# EAGLE design old_line_kick (EAGLE 7.7.0)
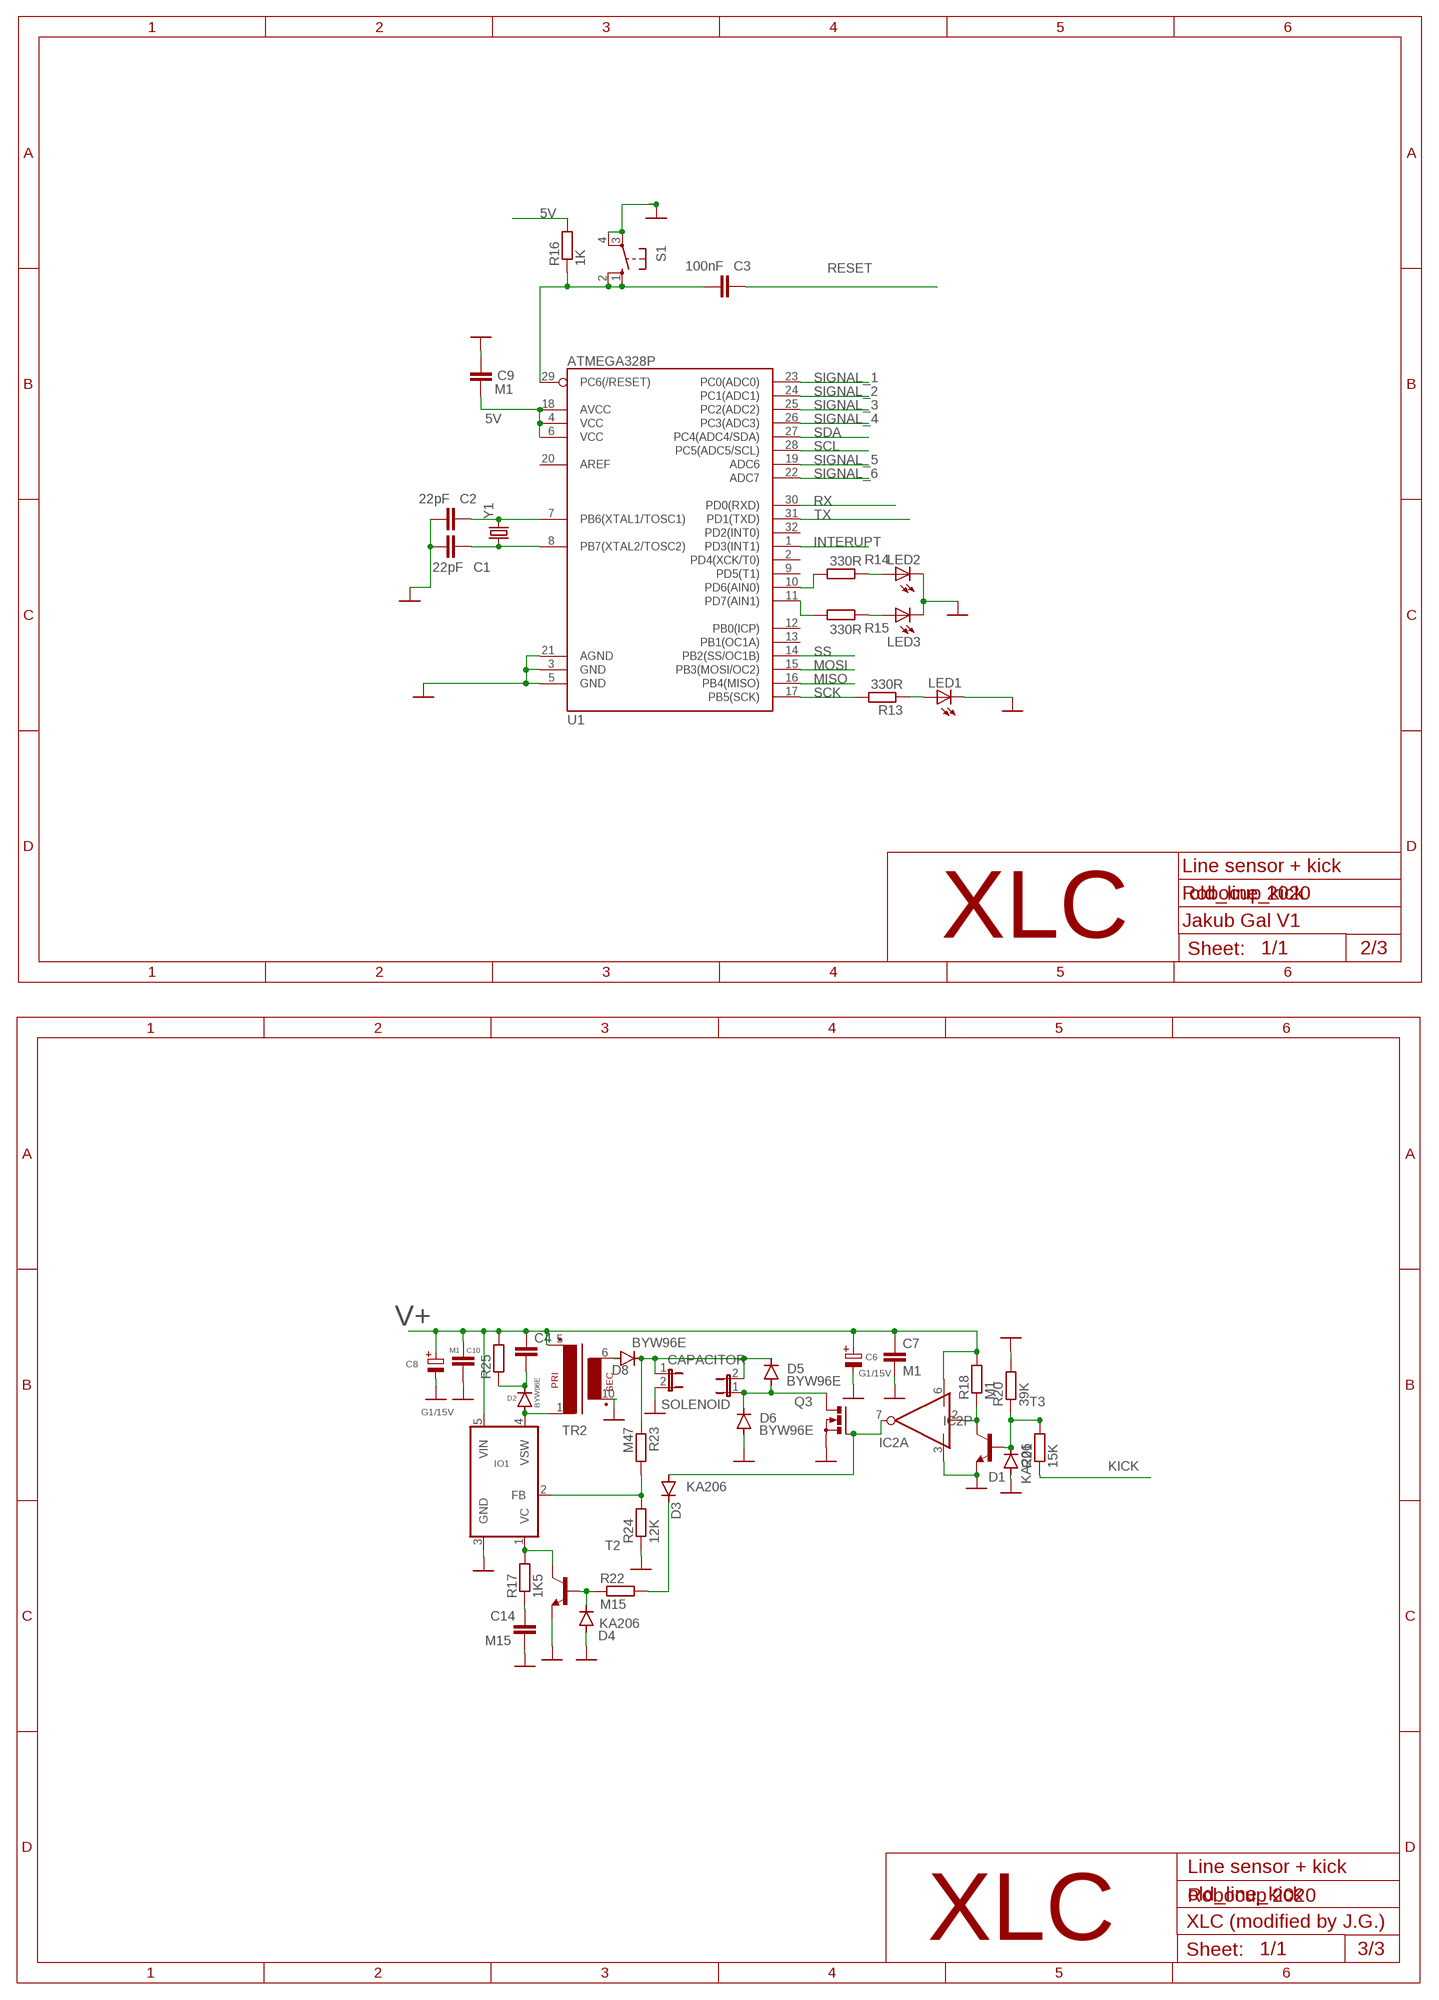
[diagram p0: schematic, sheet 1, part 1 of 2]
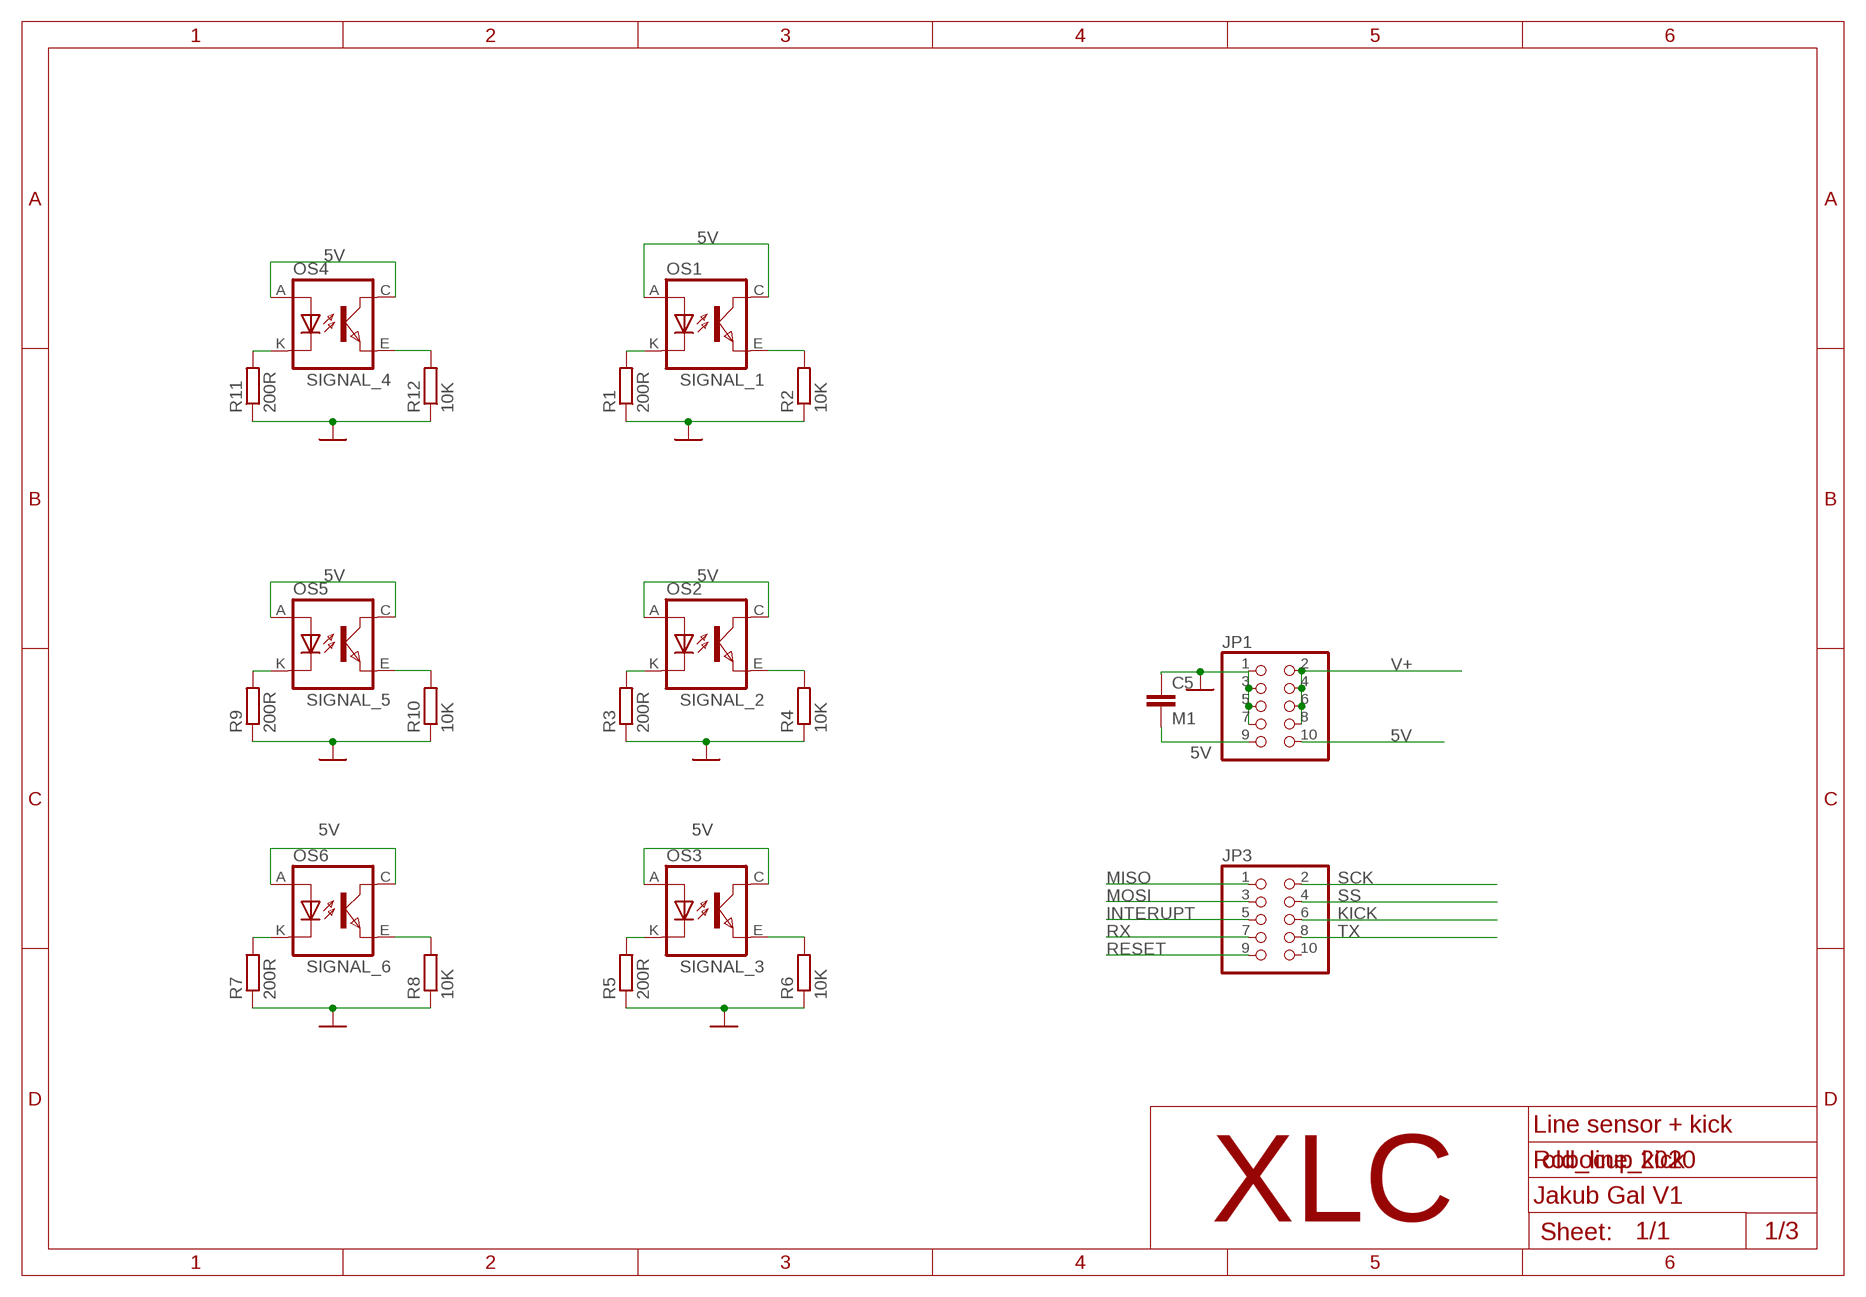
[diagram p1: schematic, sheet 1, part 2 of 2]

## Parts
C1  22pF  C-EUC0603  [C0603]
C2  22pF  C-EUC0603  [C0603]
C3  100nF  C-EUC0603  [C0603]
C4  C-EU075-052X106  [C075-052X106]
C5  M1  C-EUC0603  [C0603]
C6  G1/15V  KOND-ELEKT-2,5/7  [E-2,5/7-RAD]
C7  M1  C-EUC0805K  [C0805K]
C8  G1/15V  KOND-ELEKT-2,5/7  [E-2,5/7-RAD]
C9  M1  C-EUC0603  [C0603]
C10  M1  C-EUC0805K  [C0805K]
C14  M15  C-EUC1206  [C1206]
CAPACITOR  JP1E  [JP1]
D1  KA206  DIODE-D-7.5  [D-7.5]
D2  BYW96E  BYW96  [SOD64-10]
D3  KA206  DIODE-D-7.5  [D-7.5]
D4  KA206  DIODE-D-7.5  [D-7.5]
D5  BYW96E  BYW96  [SOD64-10]
D6  BYW96E  BYW96  [SOD64-10]
D8  BYW96E  BYW96  [SOD64-10]
IC2  MIC4423BM  [SO08]
IO1  LT1071V  [TO220-5P]
JP1  PINHD-2X5IDC  [2X05_IDC]
JP3  PINHD-2X5IDC  [2X05_IDC]
LED1  LEDCHIPLED_0603  [CHIPLED_0603]
LED2  LEDCHIPLED_0603  [CHIPLED_0603]
LED3  LEDCHIPLED_0603  [CHIPLED_0603]
OS1  TCRT5000  [TCRT5000]
OS2  TCRT5000  [TCRT5000]
OS3  TCRT5000  [TCRT5000]
OS4  TCRT5000  [TCRT5000]
OS5  TCRT5000  [TCRT5000]
OS6  TCRT5000  [TCRT5000]
Q3  PMOSFET_NTO220BV  [TO220BV]
R1  200R  R-EU_R0603  [R0603]
R2  10K  R-EU_R0603  [R0603]
R3  200R  R-EU_R0603  [R0603]
R4  10K  R-EU_R0603  [R0603]
R5  200R  R-EU_R0603  [R0603]
R6  10K  R-EU_R0603  [R0603]
R7  200R  R-EU_R0603  [R0603]
R8  10K  R-EU_R0603  [R0603]
R9  200R  R-EU_R0603  [R0603]
R10  10K  R-EU_R0603  [R0603]
R11  200R  R-EU_R0603  [R0603]
R12  10K  R-EU_R0603  [R0603]
R13  330R  R-EU_R0603  [R0603]
R14  330R  R-EU_R0603  [R0603]
R15  330R  R-EU_R0603  [R0603]
R16  1K  R-EU_R0603  [R0603]
R17  1K5  R-EU_R1206  [R1206]
R18  M1  R-EU_R1206  [R1206]
R20  39K  R-EU_R1206  [R1206]
R21  15K  R-EU_R1206  [R1206]
R22  M15  R-EU_R1206  [R1206]
R23  M47  R-EU_R1206  [R1206]
R24  12K  R-EU_R1206  [R1206]
R25  REZISTOR-7,5MM-HORIZ  [R-7,5H]
S1  10-XX  [B3F-10XX]
SOLENOID  JP1E  [JP1]
T2  -NPN-SC59-BEC  [SC59-BEC]
T3  -NPN-SC59-BEC  [SC59-BEC]
TR2  TRAFO-E10-R""  [TRAFO-EE17X20]
U1  ATMEGA328P  ATMEGA328_SMT  [TQFP32-08]
Y1  CRYSTALHC49US  [HC49US]

## Nets
5V: C5.2 C9.1 JP1.9 JP1.10 OS1.A(ANODE) OS1.C(COLLECTOR) OS2.A(ANODE) OS2.C(COLLECTOR) OS3.A(ANODE) OS3.C(COLLECTOR) OS4.A(ANODE) OS4.C(COLLECTOR) OS5.A(ANODE) OS5.C(COLLECTOR) OS6.A(ANODE) OS6.C(COLLECTOR) R16.2 U1.4(VCC) U1.6(VCC) U1.18(AVCC)
GND: C1.1 C2.1 C5.1 C6.- C7.2 C8.- C9.2 C10.2 C14.2 CAPACITOR.2 D1.A D4.A D6.A IC2.3(P:GND) IO1.3(GND) JP1.1 JP1.3 JP1.5 JP1.7 LED1.C LED2.C LED3.C Q3.S R1.1 R2.1 R3.1 R4.1 R5.1 R6.1 R7.1 R8.1 R9.1 R10.1 R11.1 R12.1 R20.2 R24.1 S1.3(P) S1.4(P1) T2.E T3.E TR2.10 U1.3(GND) U1.5(GND) U1.21(AGND)
INTERUPT: JP3.5 U1.1(PD3(INT1))
KICK: JP3.6 R21.1
MISO: JP3.1 U1.16(PB4(MISO))
MOSI: JP3.3 U1.15(PB3(MOSI/OC2))
N$1: OS1.K(CATHODE) R1.2
N$2: OS2.K(CATHODE) R3.2
N$3: OS3.K(CATHODE) R5.2
N$4: OS6.K(CATHODE) R7.2
N$5: OS5.K(CATHODE) R9.2
N$6: OS4.K(CATHODE) R11.2
N$7: C2.2 U1.7(PB6(XTAL1/TOSC1)) Y1.2
N$8: C1.2 U1.8(PB7(XTAL2/TOSC2)) Y1.1
N$9: IO1.1(VC) R17.2 T2.C
N$10: C14.1 R17.1
N$11: D8.A TR2.6
N$12: D3.A IC2.7(A:OUT) Q3.G
N$13: CAPACITOR.1 D5.C D8.C R23.1 SOLENOID.2
N$14: IO1.2(FB) R23.2 R24.2
N$15: D4.C R22.1 T2.B
N$16: C3.1 R16.1 S1.1(S) S1.2(S1) U1.29(PC6(/RESET))
N$17: LED1.A R13.1
N$18: IC2.2(A:IN) R18.1 T3.C
N$19: LED2.A R14.1
N$20: R15.2 U1.11(PD7(AIN1))
N$21: LED3.A R15.1
N$22: R14.2 U1.10(PD6(AIN0))
N$23: D2.A IO1.4(VSW) TR2.1
N$24: C4.2 D2.C R25.1
N$26: D5.A D6.C Q3.D SOLENOID.1
N$29: D3.C R22.2
N$31: D1.C R20.1 R21.2 T3.B
RESET: C3.2 JP3.9
RX: JP3.7 U1.30(PD0(RXD))
SCK: JP3.2 R13.2 U1.17(PB5(SCK))
SCL: U1.28(PC5(ADC5/SCL))
SDA: U1.27(PC4(ADC4/SDA))
SIGNAL_1: OS1.E(EMITTER) R2.2 U1.23(PC0(ADC0))
SIGNAL_2: OS2.E(EMITTER) R4.2 U1.24(PC1(ADC1))
SIGNAL_3: OS3.E(EMITTER) R6.2 U1.25(PC2(ADC2))
SIGNAL_4: OS4.E(EMITTER) R12.2 U1.26(PC3(ADC3))
SIGNAL_5: OS5.E(EMITTER) R10.2 U1.19(ADC6)
SIGNAL_6: OS6.E(EMITTER) R8.2 U1.22(ADC7)
SS: JP3.4 U1.14(PB2(SS/OC1B))
TX: JP3.8 U1.31(PD1(TXD))
V+: C4.1 C6.+ C7.1 C8.+ C10.1 IC2.6(P:V+) IO1.5(VIN) JP1.2 JP1.4 JP1.6 JP1.8 R18.2 R25.2 TR2.5
Unconnected: IC2.4(B:IN) IC2.5(B:OUT) JP3.10 U1.2(PD4(XCK/T0)) U1.9(PD5(T1)) U1.12(PB0(ICP)) U1.13(PB1(OC1A)) U1.20(AREF) U1.32(PD2(INT0))

## Notes on the sheet
- Line sensor + kick
- Robocup 2020
- Jakub Gal V1
- XLC
- 2/3
- Line sensor + kick
- Robocup 2020
- XLC (modified by J.G.)
- XLC
- 3/3
- Line sensor + kick
- Robocup 2020
- Jakub Gal V1
- XLC
- 1/3

## Library data of the parts
C1-C3 C9 = rcl@1:C-EU: CAPACITOR, European symbol
C4 C5 = rcl:C-EU: CAPACITOR, European symbol; SPICEPREFIX: C
C6 C8 = TABOR K1:KOND-ELEKT: Kondenzátor elektrolyticky
C7 C10 C14 = resistor:C-EU: CAPACITOR, European symbol
CAPACITOR SOLENOID = jumper:JP1E: JUMPER
D1 D3 D4 = diode:DIODE-: DIODE
D2 D5 D6 D8 = diode:BYW96: DIODE fast soft-recovery rectifier
IC2 = TABOR K1:MIC4423B: 2x Invertor driver MOSFET
IO1 = TABOR K1:LT1071: DC/DC pulzny IO
JP1 JP3 = pinhead-1:PINHD-2X5: PIN HEADER
LED1-LED3 = audio amplifier example:LED
OS1-OS3 OS5 = tcrt5000:TCRT5000
OS4 OS6 = tcrt5000:TCRT5000; SPICEPREFIX: O
Q3 = transistor-power:PMOSFET_N: Power MOSFET N-Channel
R1-R18 R20-R24 = rcl:R-EU_: RESISTOR, European symbol; SPICEPREFIX: R
R25 = TABOR K1:REZISTOR: REZISTOR
S1 = switch-omron:10-XX: OMRON SWITCH; MPN: B3F-1000; OC_FARNELL: 176432; OC_NEWARK: 36M3542
T2 T3 = DC_LOAD_AU:*-NPN-: NPN Transistror BF959 corrected 2008.03.06
TR2 = TABOR K1:TRAFO-E10-R: Transformátor s feritovym jadrom EE17x20: 1x primár, 1x sekundár
U1 = SparkFun-DigitalIC:ATMEGA328_SMT: 32-Pin Atmega328 part Commonly used on Arduino compatible boards Available in QFP and QFN packages TQFP is IC-09069 QFN is non-stock; PROD_ID: IC-09069
Y1 = SparkFun-FreqCtrl:CRYSTAL: Various standard crystals. Proven footprints. Spark Fun Electronics SKU : COM-00534

## Board
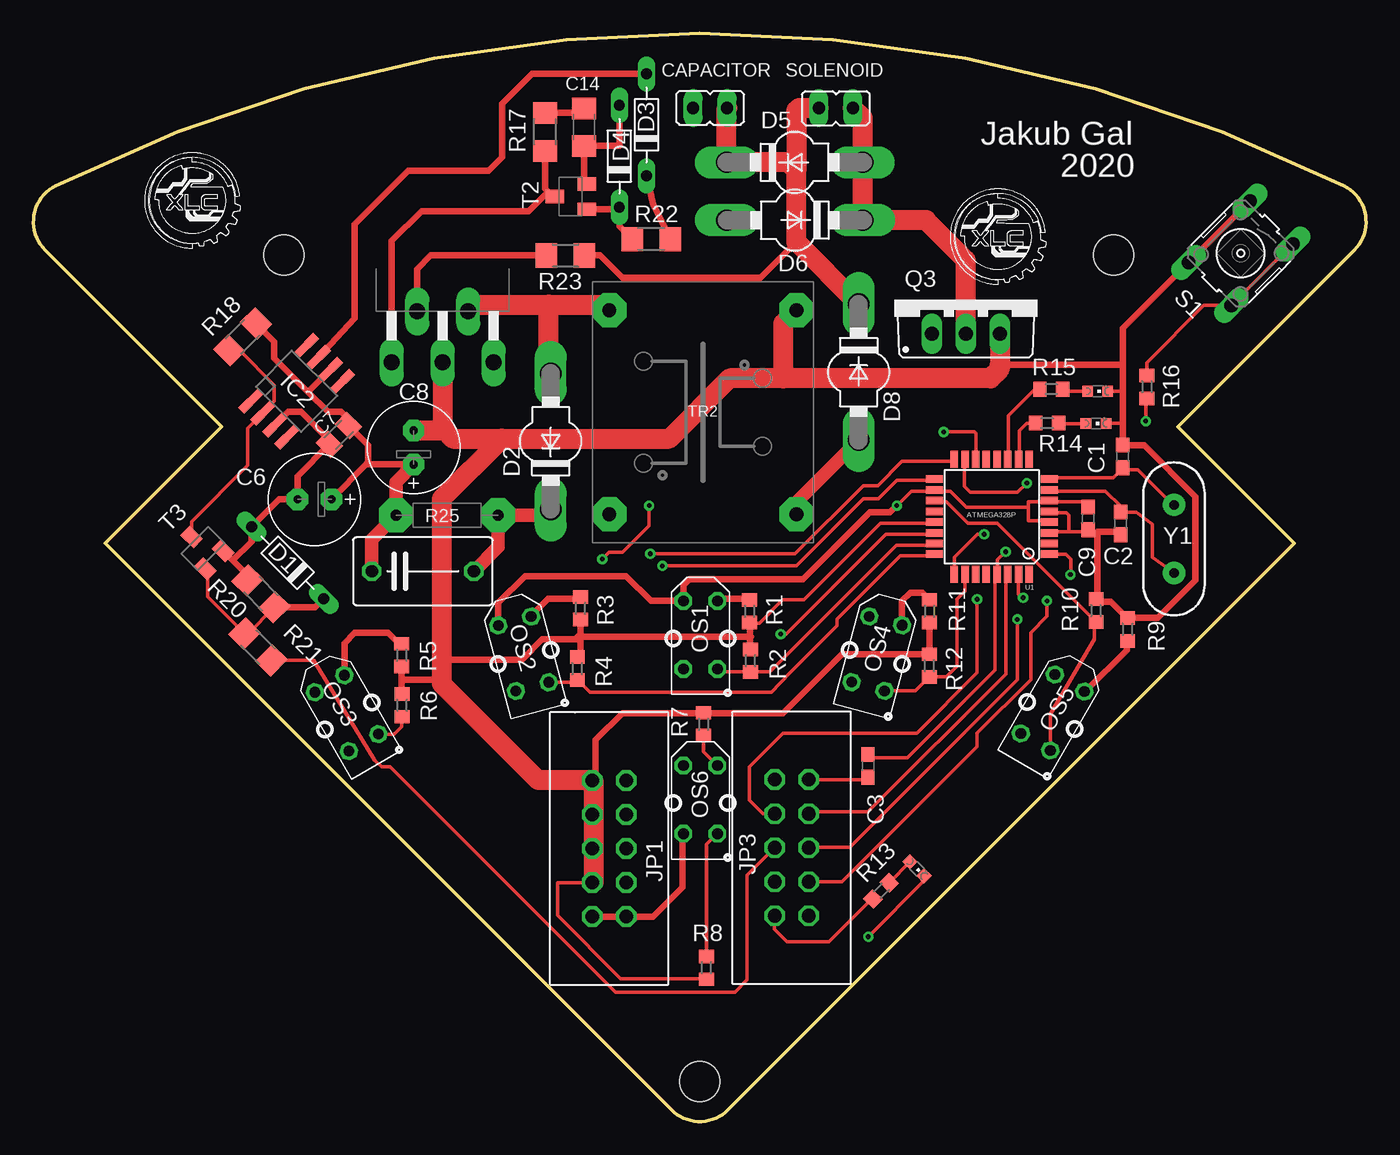
[diagram p2: board, top side]
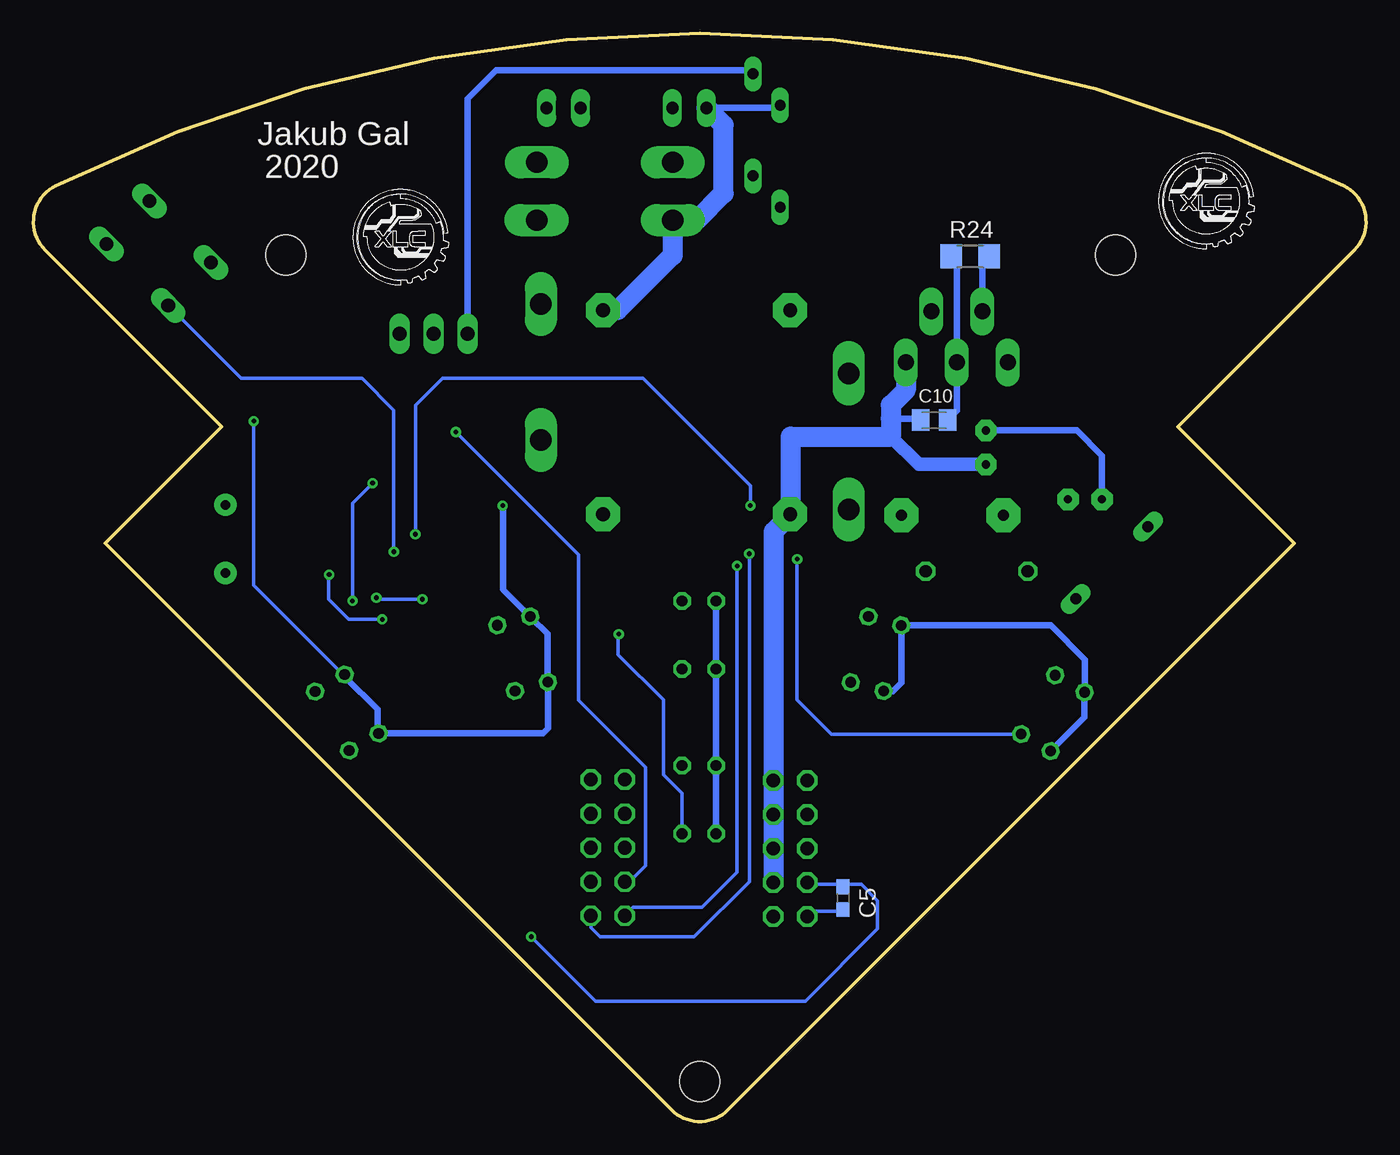
[diagram p3: board, bottom side, seen from below]

Size 99.55 x 81.25 mm. Coordinates in mm from the lower left corner, seen from the top.
Outline: 85.49,51.89 98.67,65.08 arc108 97.9,69.88 arc53 1.66,69.88 arc108 0.88,65.08 14.07,51.89 5.35,43.18 47.66,0.87 arc90 51.9,0.87 94.2,43.18 85.49,51.89
Copper layers (1*16): Top 0.035mm / dielectric 1.5mm / Bottom 0.035mm
Design rules "default *": minimum track width 0.25mm, minimum drill 0.35mm, track to track 6mil, track to pad 6mil, pad to pad 6mil, via to via 6mil, smd to smd 6mil, copper to edge 40mil, drill to drill 6mil, minimum pad ring 10mil, minimum via ring 8mil, stop-mask expansion 4mil, vias tented up to drill 0mil, thermal gap 10mil
Holes 3 mm at 49.78,3 18.71,64.71 80.71,64.71

### Footprints (pad centres in the part's own frame; a part is rotated, then mirrored left to right if it is on the bottom)
C0603 = smd 1.1 x 1: 1 -0.85,0; 2 0.85,0
C075-052X106 = drill 0.914 octagon: 1 -3.81,0; 2 3.81,0
E-2,5/7-RAD = drill 0.61 pad 1.6 octagon: + -1.27,0; - 1.27,0
C0805K = smd 1.3 x 1.6: 1 -1,0; 2 1,0
C1206 = smd 1.6 x 1.8: 1 -1.4,0; 2 1.4,0
JP1 = drill 0.914 long: 1 0,-1.27; 2 0,1.27
D-7.5 = drill 0.813 long: A 3.81,0; C -3.81,0
SOD64-10 = drill 1.6 long: A 5.08,0; C -5.08,0
SO08 = smd 0.61 x 1.981: 1 -1.905,-2.972; 2 -0.635,-2.972; 3 0.635,-2.972; 4 1.905,-2.972; 5 1.905,2.972; 6 0.635,2.972; 7 -0.635,2.972; 8 -1.905,2.972
TO220-5P = drill 1.194 pad 1.676 long: 1 -3.81,0; 2 -1.905,3.81; 3 0,0; 4 1.905,3.81; 5 3.81,0
2X05_IDC = drill 1.016 octagon: 1 -5.08,-1.27; 2 -5.08,1.27; 3 -2.54,-1.27; 4 -2.54,1.27; 5 0,-1.27; 6 0,1.27; 7 2.54,-1.27; 8 2.54,1.27; 9 5.08,-1.27; 10 5.08,1.27
CHIPLED_0603 = smd 0.8 x 0.8: A 0,-0.75; C 0,0.75
TCRT5000 = drill 0.8 octagon: A -2.54,-1.27; C 2.54,-1.27; E 2.54,1.27; K -2.54,1.27
TO220BV = drill 1.016 long: D 0,-2.54; G -2.54,-2.54; S 2.54,-2.54
R0603 = smd 1 x 1.1: 1 -0.85,0; 2 0.85,0
R1206 = smd 1.6 x 1.803: 1 -1.422,0; 2 1.422,0
R-7,5H = drill 0.813 pad 2.54 octagon: 1 -3.81,0; 2 3.81,0
B3F-10XX = drill 1.016 long: 1 -3.251,2.261; 2 3.251,2.261; 3 -3.251,-2.261; 4 3.251,-2.261
SC59-BEC = smd 1 x 1.4: B -0.95,-1.2; C 0,1.2; E 0.95,-1.2
TRAFO-EE17X20 = drill 1.016 pad 2.54 octagon: 1 -7.62,-7.62; 5 7.62,-7.62; 6 7.62,6.35; 10 -7.62,6.35
TQFP32-08 = smd 1.27 x 0.559: 1 -4.293,2.8; 2 -4.293,2; 3 -4.293,1.2; 4 -4.293,0.4; 5 -4.293,-0.4; 6 -4.293,-1.2; 7 -4.293,-2; 8 -4.293,-2.8; 17 4.293,-2.8; 18 4.293,-2; 19 4.293,-1.2; 20 4.293,-0.4; 21 4.293,0.4; 22 4.293,1.2; 23 4.293,2; 24 4.293,2.8 | smd 0.559 x 1.27: 9 -2.8,-4.293; 10 -2,-4.293; 11 -1.2,-4.293; 12 -0.4,-4.293; 13 0.4,-4.293; 14 1.2,-4.293; 15 2,-4.293; 16 2.8,-4.293; 25 2.8,4.293; 26 2,4.293; 27 1.2,4.293; 28 0.4,4.293; 29 -0.4,4.293; 30 -1.2,4.293; 31 -2,4.293; 32 -2.8,4.293
HC49US = drill 0.7 pad 1.651: 1 -2.54,0; 2 2.54,0

### Placement (x,y rotation side)
C1  81.37,49.68 270 top
C2  81.22,44.67 90 top
C3  62.34,26.56 270 top
C4  29.09,41.1 0 top
C5  39.08,16.68 270 bottom
C6  21,46.47 180 top
C7  22.81,51.28 225 top
C8  28.4,50.34 90 top
C9  78.78,45.05 270 top
C10  32.27,52.38 0 bottom
C14  41.14,74.27 270 top
CAPACITOR  50.55,75.69 90 top
D1  18.99,41.73 135 top
D2  38.65,50.8 90 top
D3  45.8,74.43 90 top
D4  43.77,72.09 90 top
D5  56.87,71.64 0 top
D6  56.88,67.31 180 top
D8  61.64,55.97 270 top
IC2  19.66,54.54 315 top
IO1  30.57,56.69 0 top
JP1  43.01,20.39 270 top
JP3  56.64,20.45 90 top
LED1  66.01,18.87 225 top
LED2  79.38,52.14 270 top
LED3  79.5,54.54 270 top
OS1  49.83,36.34 270 top
OS2  36.61,34.93 285 top
OS3  23.4,30.5 300 top
OS4  63.01,34.94 255 top
OS5  76.13,30.54 240 top
OS6  49.83,24.04 270 top
Q3  69.66,61.37 0 top
R1  53.5,38.11 90 top
R2  53.56,34.41 270 top
R3  40.87,38.33 90 top
R4  40.62,33.83 270 top
R5  27.51,34.83 90 top
R6  27.54,31.08 270 top
R7  50.06,29.68 270 top
R8  50.28,11.48 90 top
R9  81.74,36.75 270 top
R10  79.38,38.16 270 top
R11  66.94,38.12 90 top
R12  66.93,34.05 270 top
R13  63.33,17.22 225 top
R14  75.73,52.16 180 top
R15  76.04,54.69 180 top
R16  83.18,54.86 270 top
R17  38.22,73.91 270 top
R18  15.62,58.6 45 top
R20  16.99,39.42 135 top
R21  16.77,35.44 135 top
R22  46.16,65.9 0 top
R23  39.74,64.68 180 top
R24  29.57,64.61 0 bottom
R25  30.9,45.27 180 top
S1  90.19,64.85 225 top
SOLENOID  59.95,75.69 90 top
T2  40.14,69.08 90 top
T3  12.66,42.8 45 top
TR2  50.65,52.97 270 top
U1  71.59,45.17 180 top
Y1  85.21,43.51 270 top

### Tracks (layer width: path | path; a pad name or v marks a point on that pad's centre or on a via)
5V  (via drill 0.35)
  Top 0.25: 44.26,15.29 JP1.10 | 41.85,15.29 JP1.9 | 48.49,21.32 OS6.C | C9.1 78.78,46.15 78.66,46.27 76.05,46.27 U1.6 75.85,46.27 74.34,46.27 74.34,45.87 | 74.34,45.87 74.34,44.86 75.85,44.86 U1.4 | 74.34,45.87 69.71,45.87 68.5,47.08 67.4,47.08 U1.18 67.2,47.08 65.58,47.08 v64.5,46 | v83.09,52.3 83.09,53.91 R16.2
  Top 0.5: 41.85,15.29 44.26,15.29 | JP1.10 46.28,15.31 48.49,17.5 48.49,21.32 | OS2.A 34.72,38.73 36.73,40.74 44.28,40.74 46.14,38.88 OS1.A 48.56,40.06 49,40.5 57.5,40.5 62.5,45.5 64,45.5 v64.5,46
  Bottom 0.25: C5.2 39.23,15.69 41.45,15.69 41.65,15.49 JP1.9 | OS4.C 61.16,32.99 | 73.84,29.17 73.8,29.08 OS5.C | 76.25,33.19 OS5.A 76.45,33.4 83.09,40.04 v83.09,52.3 | v64.5,46 64.46,45.96 | 62.37,37.62 OS4.A 62.57,37.82 | 64.38,39.63 64.46,39.74
  Bottom 0.5: 73.84,29.17 73.84,30.78 76.25,33.19 | OS1.A OS1.C OS6.A OS6.C | 64.46,45.96 64.46,39.74 | OS4.C 61.12,29.37 61.5,29 73.72,29 73.8,29.08 | OS3.C 21.03,30.2 OS3.A 21,32.09 21,34.5 23.55,37.05 OS2.A 34.72,32.77 35.35,32.14 OS2.C | 61.16,32.99 61.16,36.41 62.37,37.62 | 64.38,39.63 62.57,37.82
GND  (via drill 0.35)
  Top 0.25: 41.85,20.52 JP1.5 41.85,20.32 | 41.85,22.73 JP1.3 41.85,22.93 | 41.85,17.9 JP1.7 39.14,17.85 39.14,15.39 43.87,10.66 50.1,10.66 R8.1 | JP1.1 41.68,25.47 41.67,25.48 | 41.85,25.35 JP1.1 | 53.61,36.21 53.56,36.16 R2.1 53.52,35.41 | R1.1 53.52,37.22 54.22,37.22 55.95,38.95 57.55,38.95 63.26,44.66 67.2,44.66 U1.21 | 79.47,38.83 R10.1 79.47,39.03 | 81.69,37.62 R9.1 81.89,37.62 | 79.47,44.06 78.87,44.06 C9.2 78.67,44.06 77.36,44.06 | 80.88,44.06 81.08,43.86 C2.1 | 77.36,44.06 76.05,44.06 U1.3 | 77.36,44.06 77.36,45.27 77.16,45.47 76.05,45.47 U1.5 | 81.48,50.5 C1.1 | 27.51,31.96 R6.1 | 30.2,33 30.5,32.7 | v62.36,13.8 66.54,17.97 LED1.C | 50.03,30.5 R7.1 50.09,30.5 | JP1.1 42,25.73 | R11.1 | LED2.C 81.23,52.14 81.37,52 | LED3.C 81.33,54.54 81.37,54.5 | 40.87,36.21 40.84,36.21 | 40.64,36.21 40.62,36
  Top 0.5: D4.A 43.77,72.87 C14.2 41.14,70.23 T2.E | T3.E 14.9,41.9 | 14.9,41.9 15.98,40.82 R20.2 | 14.9,41.9 16.29,43.29 D1.A 18.34,46.47 C6.- 19.73,48.2 C7.2 22.1,50.89 20,53 19.02,53 IC2.3 | 53.61,36.21 40.84,36.21 40.64,36.21 | 53.52,35.41 53.52,37.22 | 79.47,38.83 80.48,38.83 81.69,37.62 | 80.88,44.06 79.47,44.06 79.47,39.03 | 81.89,37.62 84,37.62 86.81,40.44 86.81,46.67 82.99,50.5 81.48,50.5 | 40.62,36 38,36 36.5,34.5 30.5,34.5 | 27.51,31.96 R5.1 27.51,33 30.2,33 | 50.03,30.5 44,30.5 42,28.5 42,25.73 | 50.09,30.5 56,30.5 60.4,34.9 R12.1 R11.1 | 72.2,56.5 81.3,56.5 81.37,56.43 | 81.37,56.43 81.37,54.5 81.37,52 C1.1 | S1.3 S1.4 81.37,59.22 81.37,56.43 | R3.1 40.87,36.21 40.87,34.93 R4.1
  Top 1.5: 41.85,22.73 41.85,20.52 | 41.85,20.32 41.85,17.9 | 41.67,25.48 37.7,25.5 30.5,32.7 30.5,34.5 30.5,46.5 35,51 | 41.85,25.35 41.85,22.93 | Q3.S 72.2,56.5 72.2,56.2 71.5,55.5 56,55.5 | 56,55.5 52,55.5 47.5,51 35,51 | TR2.10 56,59.59 56,55.5 | IO1.3 30.57,51.78 30.74,51.61 | 35,51 31.35,51 30.74,51.61 | C8.- 30.74,51.61
  Bottom 0.25: 39.23,17.7 41.65,17.7 JP1.7 | 39.23,17.7 C5.1 | 39.23,17.7 37.7,17.7 36.5,16.5 36.5,14.38 41.88,9 57.56,9 v62.36,13.8
  Bottom 0.5: C10.2 30.57,53.08 IO1.3 30.57,64.18 R24.1 | D4.A 43.98,75.69 CAPACITOR.2 | C8.- 21.61,51.61 19.73,49.73 C6.-
  Bottom 1.5: CAPACITOR.2 48,74.41 48,69.31 50,67.31 D6.A 51.8,64.69 55.91,60.59 TR2.10
INTERUPT  (via drill 0.35)
  Top 0.25: JP3.5 57.96,20.5 61,20.5 73.5,33 v73.5,37.5 | U1.1 77.13,42.37 77.5,42 77.5,40.88 v77.46,40.84
  Bottom 0.25: v73.5,37.5 76,37.5 77.5,39 77.5,40.8 v77.46,40.84
KICK
  Top 0.25: JP3.6 53.32,18.4 53.32,10.57 52.4,9.65 43.5,9.65 26.66,26.5 26,26.5 25.5,27 20.93,34.43 R21.1
MISO  (via drill 0.35)
  Top 0.25: U1.16 68.61,49.29 64.88,49.29 63.08,47.5 62,47.5 56.9,42.4 v46.08,42.4
  Bottom 0.25: v46.08,42.4 46.08,17.92 50.22,13.78 57.24,13.78 57.91,14.45 JP3.1
MOSI  (via drill 0.35)
  Top 0.25: v74.22,47.67 73.52,47 70,47 69.56,47.43 69.56,49.43 U1.15 | JP3.3 60.41,17.91 70.5,28 70.5,29 74.5,33 74.5,36.5 75.72,37.72 v75.72,38.88
  Bottom 0.25: v74.22,47.67 75.72,46.17 v75.72,38.88
N$1
  Top 0.25: 53.32,39.03 R1.2 | 51.1,39.03 OS1.K
  Top 0.5: 51.1,39.03 53.32,39.03
N$2
  Top 0.25: 40.63,39.03 R3.2 | 37.22,37.82 OS2.K
  Top 0.5: 40.63,39.03 38.43,39.03 37.22,37.82
N$3
  Top 0.25: 27.32,35.68 R5.2
  Top 0.5: OS3.K 23.23,35.73 24,36.5 26.5,36.5 27.32,35.68
N$4
  Top 0.25: OS6.K 50.06,27.62 R7.2
N$5
  Top 0.25: 81.69,35.81 R9.2 | 78.67,32.19 OS5.K
  Top 0.5: 81.69,35.81 81.69,35.21 78.67,32.19
N$6
  Top 0.5: OS4.K 64.89,38.89 65.5,39.5 66.41,39.5 R11.2
N$7
  Top 0.25: U1.7 76.05,47.08 80.07,47.08 81.22,45.93 C2.2 82.38,45.52 83.61,44.59 83.61,42.14 Y1.2
N$8
  Top 0.25: Y1.1 85.11,46.07 82.49,48.69 81.48,48.69 C1.2 81.28,48.69 80.68,48.08 76.05,48.08 U1.8
N$9
  Top 0.5: T2.C 38.81,69.08 38.44,69.44 | R17.2 38.22,69.67 38.44,69.44 | IO1.1 26.76,65.76 29,68 37,68 38.44,69.44
N$10
  Top 0.5: R17.1 41.08,75.33 C14.1
N$11
  Top 1: TR2.6 57,46.25 D8.A
N$12
  Top 0.5: D3.A 37.24,78.24 35,76 35,72 34,71 28,71 24,67 24,60 IC2.7
  Bottom 0.5: Q3.G 67.12,76.38 65,78.5 46.06,78.5 D3.A
N$13
  Top 0.5: R23.1 42.32,64.68 44,63 54.31,63 57,65.69
  Top 1.5: D8.C 57,65.69 57,71 | 57,71 56.36,71.64 D5.C 51.79,75.66 CAPACITOR.1 | SOLENOID.2 57.19,75.69 57,75.5 57,71
N$14
  Top 0.5: IO1.2 28.66,63.66 29.68,64.68 R23.2
  Bottom 0.5: IO1.2 28.66,64.09 R24.2
N$15
  Top 0.5: T2.B 43.62,68.13 D4.C 43.77,66.86 R22.1
N$16  (via drill 0.35)
  Top 0.25: v72.63,42.55 72.03,41.94 72.03,41.04 U1.29 71.83,40.84 71.83,33.71 65.3,27.18 62.57,27.18 C3.1 | R16.1 83.18,56.68 87.45,60.95 S1.2 S1.1
  Bottom 0.25: v72.63,42.55 72.63,53.13 75,55.5 84.04,55.5 S1.2
N$17
  Top 0.25: R13.1 63.93,17.85 LED1.A
N$18
  Top 0.25: T3.C 11.81,44.81 16,49 16,51.77 IC2.2 18,53.77 18,55 15.4,57.59
  Top 0.5: 15.4,57.59 R18.1
N$19
  Top 0.25: LED2.A 78.47,52.11 76.66,52.11 R14.1
N$20
  Top 0.25: R15.2 74.81,54.69 72.83,52.7 72.83,49.49 U1.11
N$21
  Top 0.25: LED3.A 78.67,54.52 77.06,54.52 R15.1
N$22
  Top 0.25: R14.2 74.2,52.16 73.64,51.6 73.64,49.49 U1.10
N$23
  Top 1.5: IO1.4 32.97,61 38.5,61 | TR2.1 42.62,61 38.5,61 | D2.A 38.5,56.03 38.5,61
N$24
  Top 1: C4.2 34.71,42.91 R25.1 38.2,45.27 D2.C
N$26
  Top 1.5: Q3.D 69.66,64.34 66.69,67.31 D6.C 61.96,71.62 D5.A 61.95,74.95 SOLENOID.1
N$29
  Top 0.5: R22.2 46.29,68.52 D3.C
N$31
  Top 0.25: R21.2 13,39.21 13,41.11 | 16.03,36.44 R20.1
  Top 0.5: R20.1 21.06,38.41 D1.C | T3.B 13,41.11 | R21.2 16.03,36.44
RESET
  Top 0.25: JP3.9 62.16,25.53 C3.2
RX
  Top 0.25: U1.30 72.63,40.84 72.63,33.41 62.36,23.13 57.94,23.13 JP3.7
SCK  (via drill 0.35)
  Top 0.25: JP3.2 55.37,14.37 56.29,13.44 59.44,13.44 62.62,16.62 R13.2 | U1.17 67.2,47.88 64.5,47.88 63.11,46.5 62,46.5 57,41.5 v46.98,41.5
  Bottom 0.25: v46.98,41.5 46.98,18.62 49.62,15.99 54.75,15.99 JP3.2
SIGNAL_1
  Top 0.25: OS1.E 51.1,33.6 53.52,33.6 R2.2 53.72,33.6 55.03,33.6 57.13,35.7 57.13,35.72 64.47,43.05 67.2,43.05 U1.23
SIGNAL_2
  Top 0.25: OS2.E 40.65,32.8 R4.2 40.84,33 40.84,32.79 41.59,32.05 55.12,32.05 56.5,33.5 60.04,37.03 60.04,37.52 64.77,42.25 67.2,42.25 U1.24
SIGNAL_3  (via drill 0.35)
  Top 0.25: v71.02,43.86 70.52,43.86 68.81,42.14 68.81,41.04 U1.25 | R6.2 27.5,30.19 27.5,29.5 26.93,28.93 OS3.E | v42.5,42 43,42.5 44,42.5 46,44.5 v46,46
  Bottom 0.25: v71.02,43.86 71.02,53.47 69,55.5 54,55.5 46,47.5 v46,46 | v42.5,42 42.5,31.5 39.93,28.93 OS3.E
SIGNAL_4
  Top 0.25: OS4.E 65.89,32.15 R12.2 68.2,33.2 69,34 69,39 69.59,39.59 U1.26
SIGNAL_5
  Top 0.25: U1.19 67.4,46.27 68.21,46.27 69.81,44.66 72.03,44.66 79.27,37.42 R10.2 79.27,37.22 79.27,36 76,30.5 75.96,30.46 OS5.E
SIGNAL_6  (via drill 0.35)
  Top 0.25: R8.2 50.3,12.47 50.3,20.72 50.9,21.32 OS6.E | v55.83,36.4 56.21,36.4 63.67,43.86 67.2,43.86 U1.22
  Bottom 0.25: OS6.E 51.1,21.52 51.1,24.5 52.5,25.89 52.5,31.5 55.87,34.86 55.87,36.36 v55.83,36.4
SS  (via drill 0.35)
  Top 0.25: U1.14 70.42,49.49 70.42,51.38 70.3,51.5 v68,51.5
  Bottom 0.25: v68,51.5 58.84,42.34 58.84,31.47 53.82,26.45 53.82,19.11 55.03,17.91 JP3.4
TX  (via drill 0.35)
  Top 0.25: U1.31 73.59,39.37 73.94,39.03 v73.94,39.11 | JP3.8 54.51,22.99 53.5,24 53.5,26.5 56,29 66,29 70.5,33.5 v70.5,39
  Bottom 0.25: v73.94,39.11 73.82,39 v70.5,39
V+
  Top 0.5: R18.2 18,58.23 18,57 20.5,54.5 | 20.5,54.5 22,53 23,53 23.52,52.48 C7.1 25,50.5 25,49.2 24.87,49.07 | IC2.6 20.52,54.5 20.5,54.5 | C6.+ 24.87,49.07 | 24.87,49.07 C8.+
  Top 1: C4.1 25.28,43.46 R25.2 27.09,47.76 C8.+
  Bottom 0.25: 43.46,44.86 TR2.5 | 44.26,25.55 JP1.2
  Bottom 0.5: TR2.5 43,45.38 | C10.1 33.39,52.5 35.5,52.5
  Bottom 1: C8.+ 33.42,49.07 35.5,51.15
  Bottom 1.5: 43,45.38 43,51.15 35.5,51.15 35.5,52.5 35.5,53.5 34.38,54.62 IO1.5 | 44.26,25.55 44.26,44.06 43.46,44.86 | JP1.2 JP1.4 JP1.6 JP1.8

### Text on the board
tNames: Jakub Gal | 2020 | R8
bNames: Jakub Gal | 2020